# EAGLE design xmas_id_badge_0.12 (EAGLE 9.3.0)
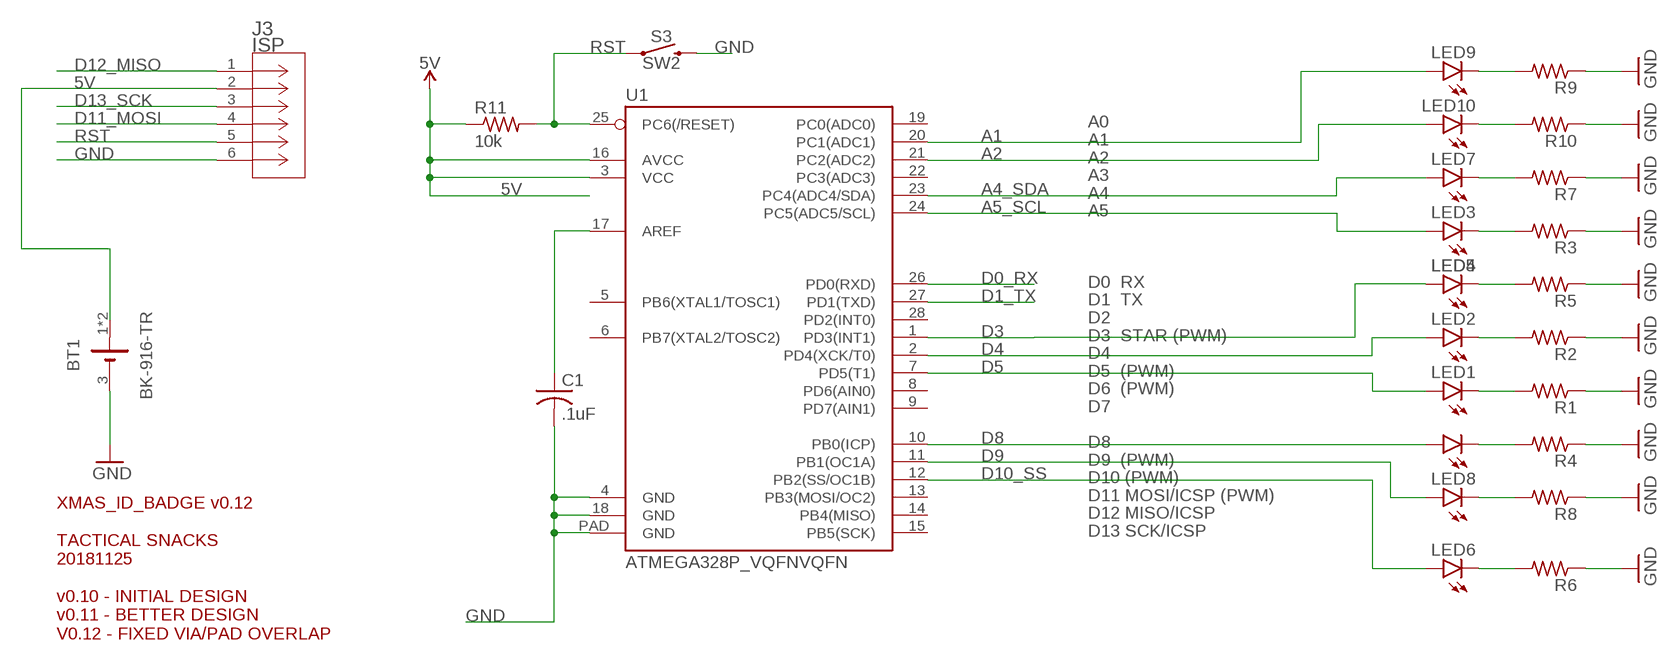
[diagram p0: schematic, sheet 1]

## Parts
BT1  BK-916-TR  [BAT_BK-916-TR]
C1  .1uF  C-USC0603  [C0603]
J3  ISP  FTSH-103-01-F-DVCON6_2X3_DU_FTSH-L_REV  [CON6_2X3_DU_FTSH-L_REV]
LED1  LEDCHIP-LED0805  [CHIP-LED0805]
LED2  LEDCHIP-LED0805  [CHIP-LED0805]
LED3  LEDCHIP-LED0805  [CHIP-LED0805]
LED4  LEDCHIP-LED0805  [CHIP-LED0805]
LED5  LEDCHIP-LED0805  [CHIP-LED0805]
LED6  LEDCHIP-LED0805  [CHIP-LED0805]
LED7  LEDCHIP-LED0805  [CHIP-LED0805]
LED8  LEDCHIP-LED0805  [CHIP-LED0805]
LED9  LEDCHIP-LED0805  [CHIP-LED0805]
LED10  LEDCHIP-LED0805  [CHIP-LED0805]
R1  R-US_R0603  [R0603]
R2  R-US_R0603  [R0603]
R3  R-US_R0603  [R0603]
R4  R-US_R0603  [R0603]
R5  R-US_R0603  [R0603]
R6  R-US_R0603  [R0603]
R7  R-US_R0603  [R0603]
R8  R-US_R0603  [R0603]
R9  R-US_R0603  [R0603]
R10  R-US_R0603  [R0603]
R11  10k  R-US_R0805  [R0805]
S3  SW2  MOMENTARY-SWITCH-SPST-SMD-6.0X3.5MM  [TACTILE_SWITCH_SMD_6.0X3.5MM]
U1  ATMEGA328P_VQFNVQFN  [VQFN-28]

## Nets
5V [pwr]: BT1.1(+) BT1.2(+) J3.2 R11.1 U1.3(VCC) U1.16(AVCC)
A1: LED9.A U1.20(PC1(ADC1))
A2: LED10.A U1.21(PC2(ADC2))
A4_SDA: LED7.A U1.23(PC4(ADC4/SDA))
A5_SCL: LED3.A U1.24(PC5(ADC5/SCL))
D0_RX [uart]: U1.26(PD0(RXD))
D1_TX [uart]: U1.27(PD1(TXD))
D3: LED5.A U1.1(PD3(INT1))
D4: LED2.A U1.2(PD4(XCK/T0))
D5: LED1.A U1.7(PD5(T1))
D8: LED4.A U1.10(PB0(ICP))
D9: LED8.A U1.11(PB1(OC1A))
D10_SS: LED6.A U1.12(PB2(SS/OC1B))
D11_MOSI: J3.4
D12_MISO: J3.1
D13_SCK: J3.3
GND: BT1.3(-) C1.2 J3.6 R1.1 R2.1 R3.1 R4.1 R5.1 R6.1 R7.1 R8.1 R9.1 R10.1 S3.2 U1.4(GND) U1.18(GND) U1.PAD(GND)
N$1: LED1.C R1.2
N$2: C1.1 U1.17(AREF)
N$3: LED2.C R2.2
N$5: LED3.C R3.2
N$7: LED4.C R4.2
N$8: LED6.C R6.2
N$9: LED5.C R5.2
N$10: LED7.C R7.2
N$11: LED8.C R8.2
N$12: LED9.C R9.2
N$13: LED10.C R10.2
RST: J3.5 R11.2 S3.1 U1.25(PC6(/RESET))
Unconnected: U1.5(PB6(XTAL1/TOSC1)) U1.6(PB7(XTAL2/TOSC2)) U1.8(PD6(AIN0)) U1.9(PD7(AIN1)) U1.13(PB3(MOSI/OC2)) U1.14(PB4(MISO)) U1.15(PB5(SCK)) U1.19(PC0(ADC0)) U1.22(PC3(ADC3)) U1.28(PD2(INT0))

## Notes on the sheet
- A0  
  A1  
  A2  
  A3  
  A4  
  A5  
  
  
  
  D0  RX
  D1  TX
  D2  
  D3  STAR (PWM)
  D4  
  D5  (PWM)
  D6  (PWM)
  D7  
  
  D8  
  D9  (PWM)
  D10 (PWM)
  D11 MOSI/ICSP (PWM)
  D12 MISO/ICSP
  D13 SCK/ICSP
- XMAS_ID_BADGE v0.12
  
  TACTICAL SNACKS
  20181125
  
  v0.10 - INITIAL DESIGN
  v0.11 - BETTER DESIGN
  V0.12 - FIXED VIA/PAD OVERLAP

## Library data of the parts
BT1 = BK-916-TR:BK-916-TR: Cr1220, 1225 Battery Retainer w/; DESCRIPTION: Cr1220, 1225 Battery Retainer w/; DIGI-KEY_PART_NUMBER: BK-916-CT-ND; DIGI-KEY_PURCHASE_URL: https://www.digikey.com/product-detail/en/mpd-memory-protection-devices/BK-916-TR/BK-916-CT-ND/6200238?utm_source=snapeda&utm_medium=aggregator&utm_campaign=symbol; MF: MPD _Memory; MP: BK-916-TR; PACKAGE: MSOP-12 Memory Protection Devices
C1 = rcl:C-US: CAPACITOR, American symbol; SPICEPREFIX: C
J3 = con-samtec2:FTSH-103-01-F-DV
LED1-LED10 = led:LED: LED OSRAM: - CHIPLED LG R971, LG N971, LY N971, LG Q971, LY Q971, LO R971, LY R971 LH N974, LH R974 LS Q976, LO Q976, LY Q976 LO Q996 - Hyper CHIPLED LW Q18S LB Q993, LB Q99A, LB R99A - SideLED LS A670, LO A670, LY A670, LG A670, LP A670 LB A673, LV A673, LT A673, LW A673 LH A674 LY A675 LS A676, LA A676, LO A676, LY A676, LW A676 LS A679, LY A679, LG A679 - Hyper Micro SIDELED® LS Y876, LA Y876, LO Y876, LY Y876 LT Y87S - SmartLED LW L88C, LW L88S LB L89C, LB L89S, LG L890 LS L89K, LO L89K, LY L89K LS L896, LA L896, LO L896, LY L896 - TOPLED LS T670, LO T670, LY T670, LG T670, LP T670 LSG T670, LSP T670, LSY T670, LOP T670, LYG T670 LG T671, LOG T671, LSG T671 LB T673, LV T673, LT T673, LW T673 LH T674 LS T676, LA T676, LO T676, LY T676, LB T676, LH T676, LSB T676, LW T676 LB T67C, LV T67C, LT T67C, LS T67K, LO T67K, LY T67K, LW E67C LS E67B, LA E67B, LO E67B, LY E67B, LB E67C, LV E67C, LT E67C LW T67C LS T679, LY T679, LG T679 LS T770, LO T770, LY T770, LG T770, LP T770 LB T773, LV T773, LT T773, LW T773 LH T774 LS E675, LA E675, LY E675, LS T675 LS T776, LA T776, LO T776, LY T776, LB T776 LHGB T686 LT T68C, LB T68C - Hyper Mini TOPLED® LB M676 - Mini TOPLED Santana® LG M470 LS M47K, LO M47K, LY M47K Source: http://www.osram.convergy.de LUXEON: - LUMILED® LXK2-PW12-R00, LXK2-PW12-S00, LXK2-PW14-U00, LXK2-PW14-V00 LXK2-PM12-R00, LXK2-PM12-S00, LXK2-PM14-U00 LXK2-PE12-Q00, LXK2-PE12-R00, LXK2-PE12-S00, LXK2-PE14-T00, LXK2-PE14-U00 LXK2-PB12-K00, LXK2-PB12-L00, LXK2-PB12-M00, LXK2-PB14-N00, LXK2-PB14-P00, LXK2-PB14-Q00 LXK2-PR12-L00, LXK2-PR12-M00, LXK2-PR14-Q00, LXK2-PR14-R00 LXK2-PD12-Q00, LXK2-PD12-R00, LXK2-PD12-S00 LXK2-PH12-R00, LXK2-PH12-S00 LXK2-PL12-P00, LXK2-PL12-Q00, LXK2-PL12-R00 Source: www.luxeon.com KINGBRIGHT: KA-3528ASYC Source: www.kingbright.com
R1-R10 = rcl:R-US_: RESISTOR, American symbol; SPICEPREFIX: R
R11 = adafruit:R-US_: RESISTOR, American symbol
S3 = SparkFun-Switches:MOMENTARY-SWITCH-SPST: Momentary Switch (Pushbutton) - SPST Normally-open (NO) SPST momentary switches (buttons, pushbuttons). Variants PTH-12MM - 12mm square, through-hole Momentary Pushbutton Switch - 12mm Square <https://www.sparkfun.com/products/9190> (COM-09190) PTH-6.0MM, PTH-6.0MM-KIT - 6.0mm square, through-hole Mini Pushbutton Switch <https://www.sparkfun.com/products/97> (COM-00097) KIT package intended for soldering kit's - only one side of pads' copper is exposed. PTH-RIGHT-ANGLE-KIT - Right-angle, through-hole Right Angle Tactile Button <https://www.sparkfun.com/products/10791> - Used on SparkFun BigTime Watch Kit <https://www.sparkfun.com/products/11734> SMD-12MM - 12mm square, surface-mount Tactile Button - SMD (12mm) <https://www.sparkfun.com/products/12993> (COM-12993) Used on SparkFun PicoBoard <https://www.sparkfun.com/products/11888> SMD-4.5MM - 4.5mm Square Trackball Switch Used on SparkFun Blackberry Trackballer Breakout <https://www.sparkfun.com/products/13169> SMD-4.6MMX2.8MM - 4.60mm x 2.80mm, surface mount Used on SparkFun SAMD21 Mini Breakout <https://www.sparkfun.com/products/13664> SMD-5.2MM, SMD-5.2-REDUNDANT - 5.2mm square, surface-mount Mini Pushbutton Switch - SMD <https://www.sparkfun.com/products/8720> (COM-08720) Used on Arduino Pro Mini <https://www.sparkfun.com/products/11114> REDUNDANT package connects both switch circuits together SMD-6.0X3.5MM - 6.0 x 3.5mm, surface mount Momentary Reset Switch SMD <https://www.sparkfun.com/products/8229> (COM-08229) SMD-6.2MM-TALL - 6.2mm square, surface mount Tactile Button - SMD (6mm) <https://www.sparkfun.com/products/12992> Used on SparkFun Digital Sandbox <https://www.sparkfun.com/products/12651> SMD-RIGHT-ANGLE - Right-angle, surface mount Used on SparkFun Block for Intel® Edison - Arduino <https://www.sparkfun.com/products/13036>; PROD_ID: SWCH-00815; SF_SKU: COM-08229
U1 = SparkFun-IC-Microcontroller:ATMEGA328P_VQFN: Atmel 328P QFN part not in catalog

## Net classes
0 default: width 0.152 mm
1 pwr: width 0.203 mm
2 pwr24: width 0.203 mm
3 uart: width 0.203 mm, clearance 0.152 mm

## Board
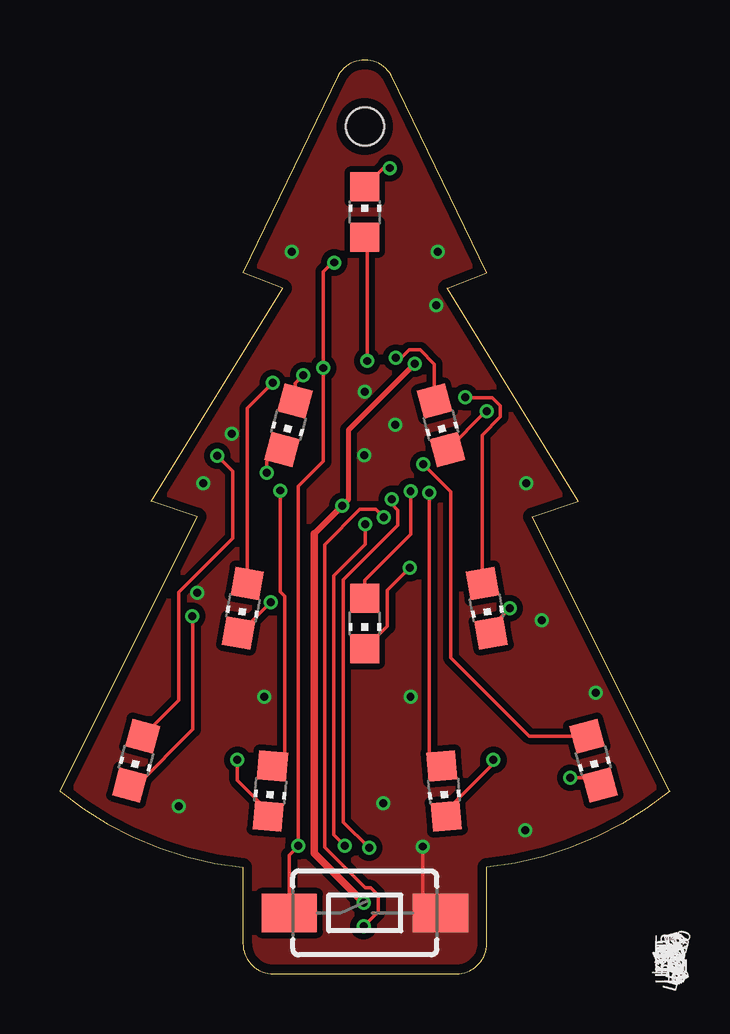
[diagram p1: board, top side]
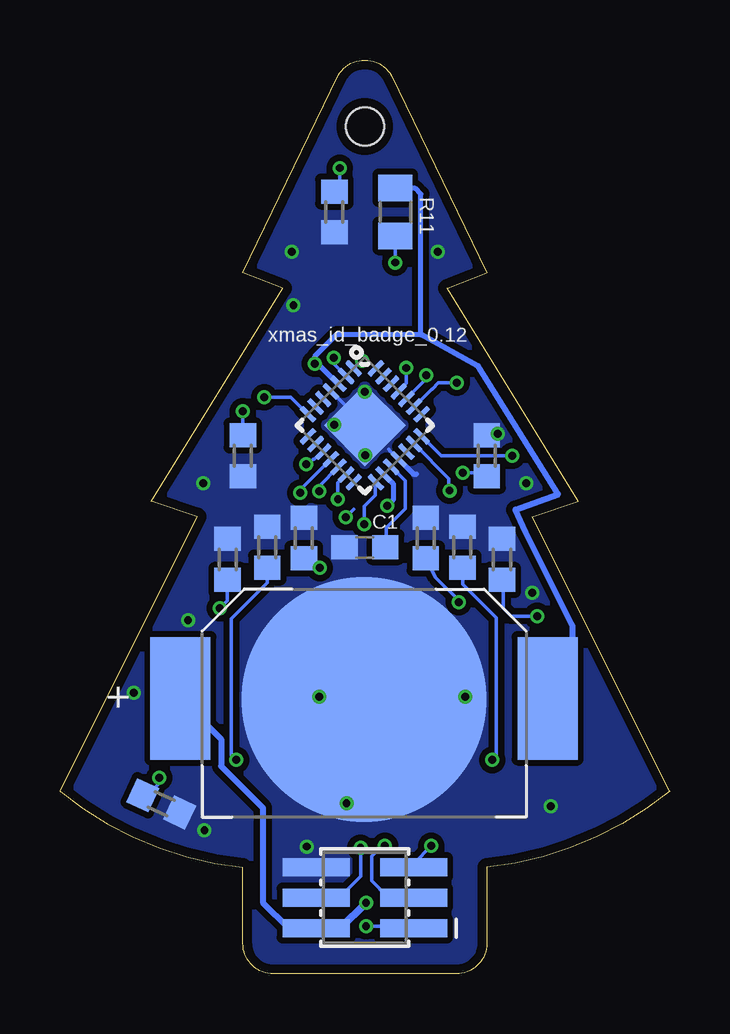
[diagram p2: board, bottom side, seen from below]

Size 25.4 x 38.08 mm. Coordinates in mm from the lower left corner, seen from the top.
Outline: 7.62,4.45 7.62,1.27 arc90 8.89,0 16.51,0 arc90 17.78,1.27 17.78,4.45 arc34 25.4,7.62 19.68,19.05 21.59,19.68 16.13,28.57 17.78,29.21 13.8,37.44 arc121 11.6,37.44 7.62,29.21 9.27,28.57 3.81,19.68 5.71,19.05 0,7.62 arc34 7.62,4.45
Copper layers (1*16): Top 0.0356mm / dielectric 1.5011mm / Bottom 0.0356mm
Design rules "LaenPCBOrder_v1.4 *": minimum track width 6mil, minimum drill 10mil, track to track 8mil, track to pad 8mil, pad to pad 8mil, via to via 8mil, smd to smd 6mil, copper to edge 15mil, drill to drill 6mil, minimum pad ring 5mil, minimum via ring 5mil, stop-mask expansion 4mil, vias tented up to drill 20mil, thermal gap 10mil
Holes 1.59 mm at 12.7,35.31

### Footprints (pad centres in the part's own frame; a part is rotated, then mirrored left to right if it is on the bottom)
BAT_BK-916-TR = smd 2.5 x 5.1: 1 -7.65,0.05; 2 7.65,0.05 | smd 10.2 x 10.2: 3 0,0
C0603 = smd 1.1 x 1: 1 -0.85,0; 2 0.85,0
CON6_2X3_DU_FTSH-L_REV = smd 0.762 x 2.794: 1 -1.27,-2.032; 2 -1.27,2.032; 3 0,-2.032; 4 0,2.032; 5 1.27,-2.032; 6 1.27,2.032
CHIP-LED0805 = smd 1.2 x 1.2: A 0,-1.05; C 0,1.05
R0603 = smd 1 x 1.1: 1 -0.85,0; 2 0.85,0
R0805 = smd 1.1 x 1.4: 1 -1,0; 2 1,0
TACTILE_SWITCH_SMD_6.0X3.5MM = smd 2.3 x 1.6: 1 -3.15,0; 2 3.15,0
VQFN-28 = smd 0.82 x 0.24: 1 -2,1.35; 2 -2,0.9; 3 -2,0.45; 4 -2,0; 5 -2,-0.45; 6 -2,-0.9; 7 -2,-1.35; 15 2,-1.35; 16 2,-0.9; 17 2,-0.45; 18 2,0; 19 2,0.45; 20 2,0.9; 21 2,1.35 | smd 0.24 x 0.82: 8 -1.35,-2; 9 -0.9,-2; 10 -0.45,-2; 11 0,-2; 12 0.45,-2; 13 0.9,-2; 14 1.35,-2; 22 1.35,2; 23 0.9,2; 24 0.45,2; 25 0,2; 26 -0.45,2; 27 -0.9,2; 28 -1.35,2 | smd 2.4 x 2.4: PAD 0,0

### Placement (x,y rotation side)
BT1  12.73,11.43 0 bottom
C1  12.7,17.78 180 bottom
J3  12.7,3.17 90 bottom
LED1  17.78,15.24 190 top
LED2  15.88,22.86 195 top
LED3  9.53,22.86 165 top
LED4  22.23,8.89 195 top
LED5  12.7,31.75 0 top
LED6  12.7,14.61 180 top
LED7  7.62,15.24 170 top
LED8  16,7.62 185 top
LED9  8.76,7.62 175 top
LED10  3.17,8.89 165 top
R1  18.41,17.27 270 bottom
R2  17.78,21.59 90 bottom
R3  7.62,21.59 270 bottom
R4  21.18,7.09 155 bottom
R5  13.97,31.75 90 bottom
R6  15.24,18.16 270 bottom
R7  10.16,18.16 270 bottom
R8  16.76,17.78 270 bottom
R9  8.64,17.78 270 bottom
R10  6.99,17.27 270 bottom
R11  11.43,31.75 270 bottom
S3  12.7,2.54 0 top
U1  12.7,22.86 315 bottom

### Tracks (layer width: path | path; a pad name or v marks a point on that pad's centre or on a via)
5V  (via drill 0.33)
  Top 0.203: v11.76,19.51 12.01,19.76 12.01,22.66 v14.78,25.43
  Top 0.254: v11.76,19.51 10.59,18.34
  Top 0.305: v12.65,2.97 10.59,5.03 10.59,18.34
  Bottom 0.203: v11.76,19.51 11.51,19.76 11.51,20.42 11.89,20.8 U1.16 | U1.3 13.82,24.59 14.66,25.43 v14.78,25.43 14.78,25.73 13.87,26.64 10.36,26.64 10.36,26.65 10.36,32.49 10.63,32.75 R11.1
  Bottom 0.254: BT1.1 18.68,9.78 18.68,8.66 16.94,6.92 16.94,2.97 15.88,1.91 J3.2 | 10.36,26.65 7.98,25.32 4.65,19.99 6.42,19.35 6.01,18.42 4.06,14.54 4.06,12.5 BT1.2
  Bottom 0.305: J3.2 13.72,1.91 v12.65,2.97
A1  (via drill 0.33)
  Top 0.152: v9.17,20.14 9.17,15.92 9.36,15.73 9.36,9.17 LED9.A
  Bottom 0.152: U1.20 9.2,20.63 9.2,20.17 v9.17,20.14
A2  (via drill 0.33)
  Top 0.152: LED10.A 4.94,11.4 4.94,15.91 7.19,18.16 7.19,20.95 v6.55,21.59
  Bottom 0.152: U1.21 9.52,21.59 v6.55,21.59
A4_SDA  (via drill 0.33)
  Top 0.152: v8.87,24.63 7.8,23.57 LED7.A
  Bottom 0.152: U1.23 9.92,24.37 9.9,24.37 9.63,24.64 v8.87,24.64 v8.87,24.63
A5_SCL  (via drill 0.33)
  Top 0.152: LED3.A 9.8,24.61 v10.13,24.94
  Bottom 0.152: v10.13,24.94 10.13,24.79 U1.24
D3  (via drill 0.33)
  Top 0.152: LED5.A 12.8,30.6 v12.8,25.54
  Bottom 0.152: U1.1 12.84,25.55 12.79,25.55 v12.8,25.54
D4  (via drill 0.33)
  Top 0.152: v13.99,25.67 14.22,25.67 14.55,26 15.02,26 15.6,25.41 LED2.A
  Bottom 0.152: U1.2 13.99,25.43 v13.99,25.67
D5  (via drill 0.33)
  Top 0.152: v16.89,24.03 16.9,24.02 18.02,24.02 18.35,23.68 18.35,23.21 17.6,22.45 LED1.A
  Bottom 0.152: U1.7 15.78,24.03 v16.89,24.03
D8  (via drill 0.33)
  Top 0.152: v15.13,21.24 16.28,20.09 16.28,13.18 19.56,9.9 LED4.A
  Bottom 0.152: U1.10 14.5,21.76 14.81,21.45 14.84,21.45 15.09,21.21 15.12,21.24 v15.13,21.24
D9  (via drill 0.33)
  Top 0.152: LED8.A 15.39,9.18 v15.39,20.04
  Bottom 0.152: U1.11 15.37,20.19 15.37,20.07 v15.39,20.04
D10_SS  (via drill 0.33)
  Top 0.152: v14.61,20.12 14.61,18.31 12.7,16.41 LED6.A
  Bottom 0.152: U1.12 14.61,20.32 v14.61,20.12
D11_MOSI  (via drill 0.33)
  Top 0.152: v13.82,19.79 13.82,19.58 14.07,19.33 14.07,18.69 11.81,16.43 11.81,6.33 v12.88,5.26
  Bottom 0.152: 13.49,20.8 13.82,20.47 v13.82,19.79 | v12.88,5.26 12.88,4.06 13.74,3.2 14.71,3.2 J3.4
D12_MISO  (via drill 0.33)
  Top 0.152: v13.49,19.02 13.16,19.36 12.5,19.36 11.02,17.88 11.02,5.28 12.72,3.58 12.95,3.58 13.26,3.28 13.26,2.59 v12.65,1.98
  Bottom 0.152: v12.65,1.98 10.74,1.98 J3.1 | v13.49,19.02 13.16,19.35
D13_SCK  (via drill 0.33)
  Top 0.152: v12.72,18.75 12.72,17.91 11.4,16.59 11.4,5.79 v11.86,5.33
  Bottom 0.152: 12.27,20.42 12.27,19.94 12.72,19.48 v12.72,18.75 | v11.86,5.33 11.99,5.33 12.42,4.9 12.42,3.89 11.73,3.2 10.67,3.2 J3.3
GND  (via drill 0.33)
  Top 0.152: v15.11,5.31 15.11,3.28 S3.2
  Bottom 0.152: U1.18 11.35,21.49 11.66,21.79 11.7,21.86 | 12.72,22.86 U1.PAD | U1.4 14.09,24.27 13.14,23.33
  Bottom 0.203: U1.18 10.67,20.83 10.54,20.83
  other vias: 5.97,20.45 14.61,11.56 8.51,11.56 19.43,20.45 9.65,30.1 15.75,30.1 15.67,27.86 19.38,5.99 20.07,14.73 13.46,7.11 4.95,6.99 5.71,15.88 12.7,24.26 12.67,21.62 13.97,22.89 7.16,22.5 22.33,11.71
  pour Top (isolate 0.254, no thermals): 0,0 0,38.1 25.4,38.1 25.4,0
  pour Bottom (isolate 0.254, no thermals): 0,0 0,38.1 25.4,38.1 25.4,0
N$1  (via drill 0.33)
  Top 0.152: v18.75,15.24 17.75,14.25 LED1.C
  Bottom 0.152: v18.75,15.24 18.44,15.54 18.44,16.41 R1.2
N$2
  Bottom 0.152: U1.17 11.58,21.11 11.02,20.55 11.02,19.38 11.81,18.59 11.81,17.83 C1.1
N$3  (via drill 0.33)
  Top 0.152: v17.78,23.44 17.75,23.44 LED2.C
  Bottom 0.152: R2.2 v17.78,23.44
N$5  (via drill 0.33)
  Top 0.152: v8.61,20.88 8.61,21.36 9.1,21.85 LED3.C
  Bottom 0.152: v8.61,20.88 7.87,20.88 7.62,21.13 R3.2
N$7  (via drill 0.33)
  Top 0.152: v21.26,8.18 21.79,8.18 22.13,7.84 LED4.C
  Bottom 0.152: R4.2 21.76,7.45 21.26,7.95 v21.26,8.18
N$8  (via drill 0.33)
  Top 0.152: v14.58,16.92 13.64,15.98 13.64,14.48 12.72,13.56 LED6.C
  Bottom 0.152: R6.2 14.97,17.31 v14.58,16.92
N$9  (via drill 0.33)
  Top 0.152: v13.74,33.58 13.48,33.58 LED5.C
  Bottom 0.152: v13.74,33.58 13.74,32.83 R5.2
N$10  (via drill 0.33)
  Top 0.152: v8.79,15.49 7.62,14.33 LED7.C
  Bottom 0.152: v8.79,15.49 8.79,15.57 9.73,16.52 R7.2
N$11  (via drill 0.33)
  Top 0.152: v18.06,8.91 18.06,8.76 15.96,6.66 LED8.C
  Bottom 0.152: R8.2 16.76,16.31 18.26,14.81 18.26,9.12 v18.06,8.91
N$12  (via drill 0.33)
  Top 0.152: v7.39,8.91 7.39,8.08 8.81,6.66 LED9.C
  Bottom 0.152: v7.39,8.91 7.21,9.09 7.21,14.83 8.61,16.23 8.61,16.92 R9.2
N$13  (via drill 0.33)
  Top 0.152: v5.51,14.91 5.54,14.88 5.54,10.19 3.2,7.85 LED10.C
  Bottom 0.152: v5.51,14.91 6.6,14.91 6.93,15.24 6.93,16.41 R10.2
RST  (via drill 0.33)
  Top 0.152: v11.43,29.64 11.35,29.64 10.97,29.26 v10.97,25.25 10.97,21.36 9.93,20.32 v9.93,5.33 9.55,4.95 S3.1
  Bottom 0.152: v10.97,25.25 10.97,24.61 11.28,24.31 U1.25 | R11.2 v11.43,29.64 | J3.5 10.67,4.6 v9.93,5.33

### Text on the board
bPlace: R11 | xmas_id_badge_0.12 | C1